# Altium schematic sheet LCD.SchDoc
size A4
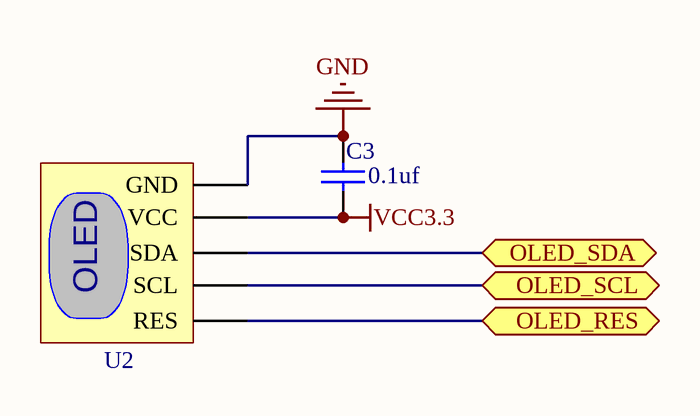
[diagram p0: LCD.SchDoc]

## Parts
C3  value 0.1uf  [0603]  (hidden comment: Capacitor-0603)
U2  0.49OLED  [0.49OLED]  (value not drawn)

## Ports
OLED_RES, OLED_SCL, OLED_SDA

## Nets
GND: C3.2 U2.1(GND)
VCC3.3: C3.1 U2.2(VCC)
OLED_RES: U2.5(RES) ; port OLED_RES
OLED_SCL: U2.4(SCL) ; port OLED_SCL
OLED_SDA: U2.3(SDA) ; port OLED_SDA

## Notes on the sheet
- (in symbol 0.49OLED) OLED

## Library data of the parts
U2 = 0.49OLED: Name: 0.49OLED